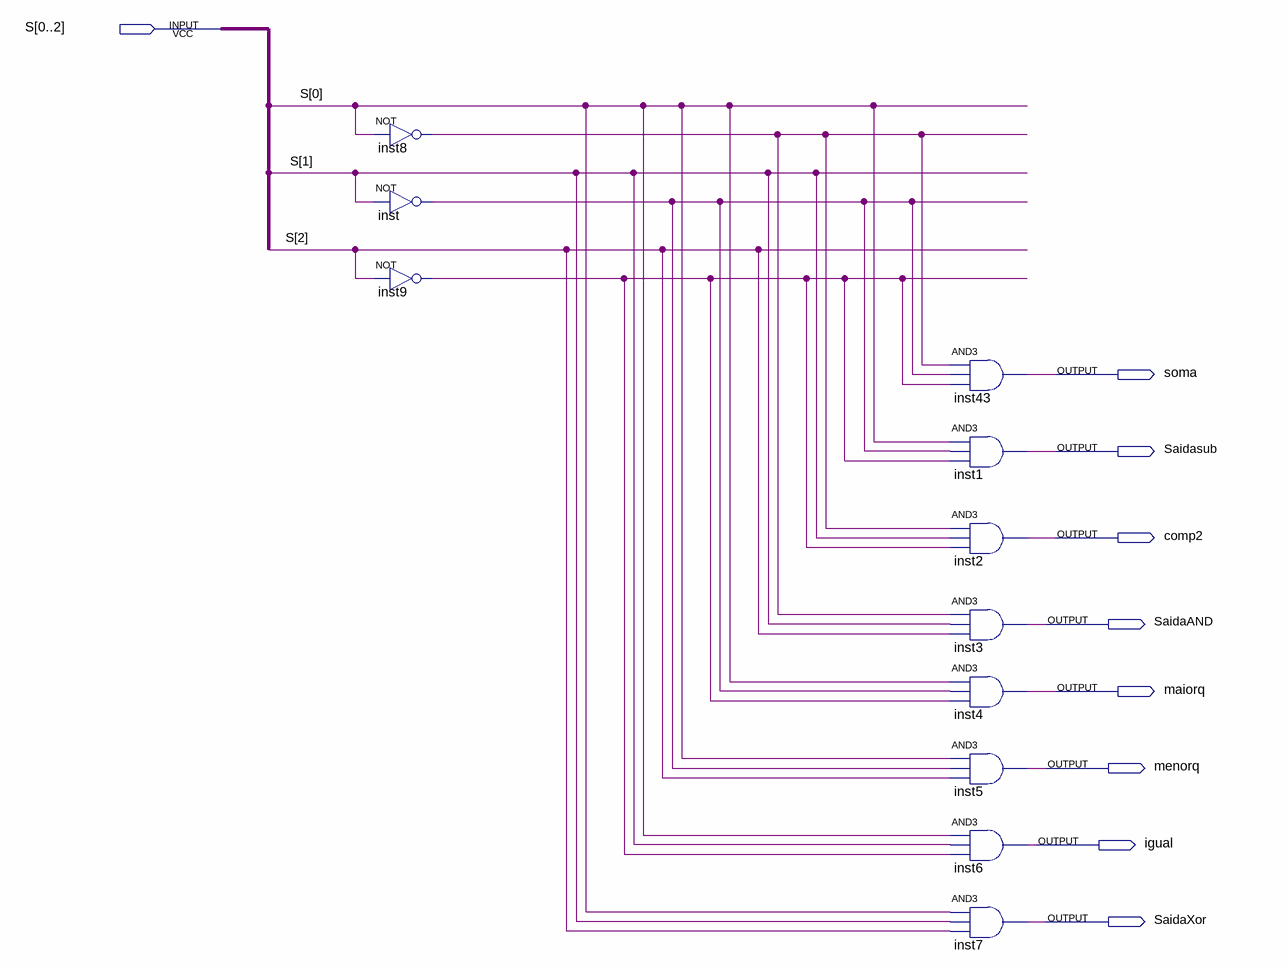
[diagram p0: schematic sheet]
// Quartus schematic SeletorOK.bdf as structural Verilog: 11 symbols, 9 pins
module SeletorOK (
  input  [0:2] S,
  output soma,
  output Saidasub,
  output comp2,
  output SaidaAND,
  output maiorq,
  output menorq,
  output igual,
  output SaidaXor
);

  wire inst8_out, inst9_out, inst_out;

  not inst8 (inst8_out, S[0]);
  not inst (inst_out, S[1]);
  not inst9 (inst9_out, S[2]);
  and inst43 (soma, inst8_out, inst_out, inst9_out);
  and inst1 (Saidasub, S[0], inst_out, inst9_out);
  and inst2 (comp2, inst8_out, S[1], inst9_out);
  and inst3 (SaidaAND, inst8_out, S[1], S[2]);
  and inst4 (maiorq, S[0], inst_out, inst9_out);
  and inst5 (menorq, S[0], inst_out, S[2]);
  and inst6 (igual, S[0], S[1], inst9_out);
  and inst7 (SaidaXor, S[0], S[1], S[2]);
endmodule
